# Altium schematic sheet E16-02-001.SchDoc
size A4
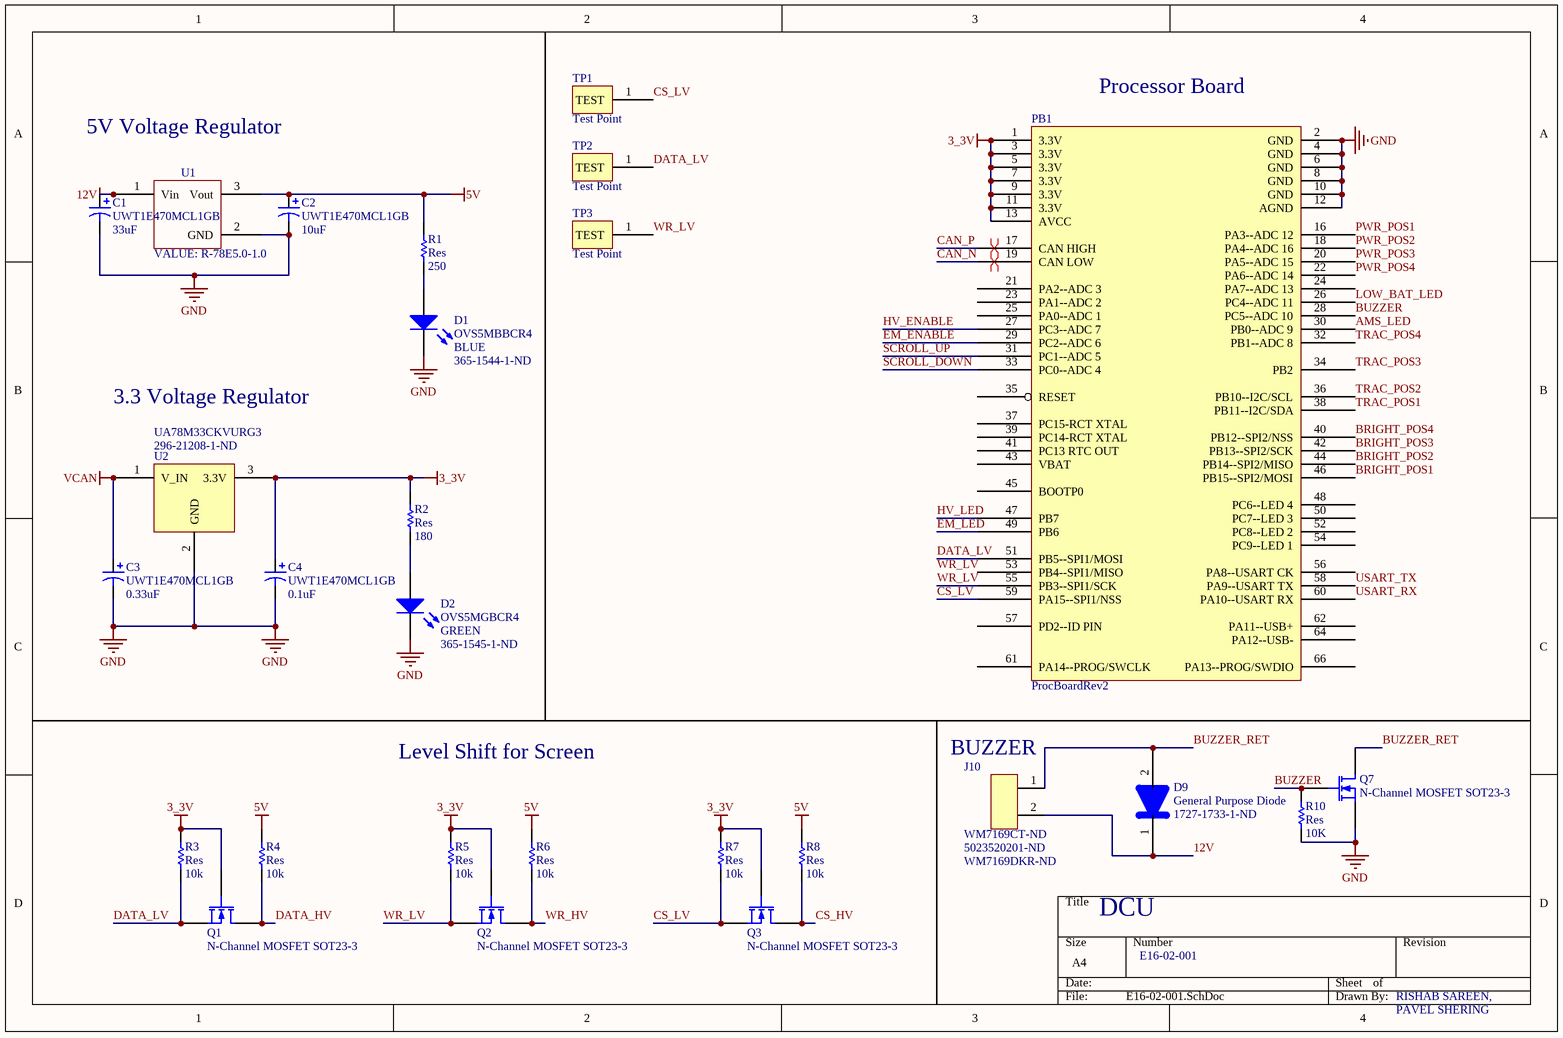
[diagram p0: E16-02-001.SchDoc]

## Parts
C1  UWT1E470MCL1GB  value 33uF  [UWT1E470MCL1GB]
C2  UWT1E470MCL1GB  value 10uF  [UWT1E470MCL1GB]
C3  UWT1E470MCL1GB  value 0.33uF  [UWT1E470MCL1GB]
C4  UWT1E470MCL1GB  value 0.1uF  [UWT1E470MCL1GB]
D1  OVS5MBBCR4  Colour: BLUE  Supplier Part Number 1: 365-1544-1-ND  [OVS5MBBCR4]
D2  OVS5MGBCR4  Colour: GREEN  Supplier Part Number 1: 365-1545-1-ND  [OVS5MGBCR4]
D9  General Purpose Diode  Digikey P/N: 1727-1733-1-ND  [SODFL350X110-2N]
J10  Supplier Part Number 1: 5023520201-ND  Supplier Part Number 2: WM7169DKR-ND  [MOLEX_DURACLIK_2]  (hidden comment: J_5023520200)
PB1  ProcBoardRev2  [PROC_BOARD]
Q1  N-Channel MOSFET SOT23-3  [SOT23-3]
Q2  N-Channel MOSFET SOT23-3  [SOT23-3]
Q3  N-Channel MOSFET SOT23-3  [SOT23-3]
Q7  N-Channel MOSFET SOT23-3  [SOT23-3]
R1  Res  value 250  [3216[1206]]
R2  Res  value 180  [3216[1206]]
R3  Res  value 10k  [3216[1206]]
R4  Res  value 10k  [3216[1206]]
R5  Res  value 10k  [3216[1206]]
R6  Res  value 10k  [3216[1206]]
R7  Res  value 10k  [3216[1206]]
R8  Res  value 10k  [3216[1206]]
R10  Res  value 10K  [3216[1206]]
TP1  Test Point  [TEST POINT 5000K]
TP2  Test Point  [TEST POINT 5000K]
TP3  Test Point  [TEST POINT 5000K]
U1  R-78E5.0-1.0  [R-78E5.0-1.0]
U2  UA78M33CKVURG3  Supplier Part Number 1: 296-21208-1-ND  [TO-252-3]

## Nets
3_3V: C4.1 PB1.1(3.3V) PB1.3(3.3V) PB1.5(3.3V) PB1.7(3.3V) PB1.9(3.3V) PB1.11(3.3V) PB1.13(AVCC) Q1.1(G) Q2.1(G) Q3.1(G) R2.2 R3.2 R5.2 R7.2 U2.3(3.3V)
5V: C2.1 R1.2 R4.2 R6.2 R8.2 U1.3(Vout)
12V: C1.1 D9.1 J10.2 U1.1(Vin)
GND: C1.2 C2.2 C3.2 C4.2 D1.2(K) D2.2(K) PB1.2(GND) PB1.4(GND) PB1.6(GND) PB1.8(GND) PB1.10(GND) PB1.12(AGND) Q7.2(S) R10.1 U1.2(GND) U2.2(GND)
VCAN: C3.1 U2.1(V_IN)
AMS_LED: PB1.30(PB0--ADC_9)
BRIGHT_POS1: PB1.46(PB15--SPI2/MOSI)
BRIGHT_POS2: PB1.44(PB14--SPI2/MISO)
BRIGHT_POS3: PB1.42(PB13--SPI2/SCK)
BRIGHT_POS4: PB1.40(PB12--SPI2/NSS)
BUZZER: PB1.28(PC5--ADC_10) Q7.1(G) R10.2
BUZZER_RET: D9.2 J10.1 Q7.3(D)
CAN_N: PB1.19(CAN_LOW)
CAN_P: PB1.17(CAN_HIGH)
CS_HV: Q3.3(D) R8.1
CS_LV: PB1.59(PA15--SPI1/NSS) Q3.2(S) R7.1 TP1.1(TEST)
DATA_HV: Q1.3(D) R4.1
DATA_LV: PB1.51(PB5--SPI1/MOSI) Q1.2(S) R3.1 TP2.1(TEST)
EM_ENABLE: PB1.29(PC2--ADC_6)
EM_LED: PB1.49(PB6)
HV_ENABLE: PB1.27(PC3--ADC_7)
HV_LED: PB1.47(PB7)
LOW_BAT_LED: PB1.26(PC4--ADC_11)
PWR_POS1: PB1.16(PA3--ADC_12)
PWR_POS2: PB1.18(PA4--ADC_16)
PWR_POS3: PB1.20(PA5--ADC_15)
PWR_POS4: PB1.22(PA6--ADC_14)
SCROLL_DOWN: PB1.33(PC0--ADC_4)
SCROLL_UP: PB1.31(PC1--ADC_5)
TRAC_POS1: PB1.38(PB11--I2C/SDA)
TRAC_POS2: PB1.36(PB10--I2C/SCL)
TRAC_POS3: PB1.34(PB2)
TRAC_POS4: PB1.32(PB1--ADC_8)
USART_RX: PB1.60(PA10--USART_RX)
USART_TX: PB1.58(PA9--USART_TX)
WR_HV: Q2.3(D) R6.1
WR_LV: PB1.55(PB3--SPI1/SCK) Q2.2(S) R5.1 TP3.1(TEST)
NetD1_1: D1.1(A) R1.1
NetD2_1: D2.1(A) R2.1

Not connected (* = marked no-connect by the designer): PB1 14(NC) 15(NC) 21(PA2--ADC_3) 23(PA1--ADC_2) 24(PA7--ADC_13) 25(PA0--ADC_1) 35(RESET) 37(PC15-RCT_XTAL) 39(PC14-RCT_XTAL) 41(PC13_RTC_OUT) 43(VBAT) 45(BOOTP0) 48(PC6--LED_4) 50(PC7--LED_3) 52(PC8--LED_2) 53(PB4--SPI1/MISO) 54(PC9--LED_1) 56(PA8--USART_CK) 57(PD2--ID_PIN) 61(PA14--PROG/SWCLK) 62(PA11--USB+) 63(NC) 64(PA12--USB-) 65(NC) 66(PA13--PROG/SWDIO) 67

## Layout directives
differential pair: CAN_N, CAN_P

## Notes on the sheet
- (near PB1) Processor Board
- 5V Voltage Regulator
- 3.3 Voltage Regulator
- Level Shift for Screen
- (near J10) BUZZER
- DCU
- E16-02-001
- RISHAB SAREEN,
- PAVEL SHERING
- Labels drawn without touching a wire or pin: WR_LV

## Library data of the parts
C1-C4 = UWT1E470MCL1GB: CAP ALUM 47UF 25V 20% SMD; Published: 8-Jun-2000; LatestRevisionDate: 17-Jul-2002; LatestRevisionNote: Re-released for DXP Platform.; PackageReference: POLAR0.8; Publisher: Altium Limited; PackageDescription: Polarized Capacitor; 2 Leads
D1 = OVS5MBBCR4: Typical BLUE LED; Published: 8-Jun-2000; LatestRevisionDate: 17-Jul-2002; LatestRevisionNote: Re-released for DXP Platform.; PackageDocument: Feb-2002; PackageReference: 3.2X1.6X1.1; Publisher: Altium Limited; Supplier 1: Digi-Key
D2 = OVS5MGBCR4: Typical GREEN LED; Published: 8-Jun-2000; LatestRevisionDate: 17-Jul-2002; LatestRevisionNote: Re-released for DXP Platform.; PackageDocument: Feb-2002; PackageReference: 3.2X1.6X1.1; Publisher: Altium Limited; Supplier 1: Digi-Key
J10 = J_5023520200: MOLEX DURACLIK 2-PIN RA; Digikey_PN: WM7169CT-ND; Supplier 1: Digi-Key; Supplier 2: Digi-Key
PB1 = ProcBoardRev2: Processor board that carries the STM32F072RB
Q1-Q3 Q7 = MOSFET-N SOT23-3
R1-R8 R10 = Res: Surface Mount Resistor; Published: 8-Jun-2000; LatestRevisionDate: 17-Jul-2002; LatestRevisionNote: Re-released for DXP Platform.; PackageReference: AXIAL-0.5; Publisher: Altium Limited
TP1-TP3 = Test Point: 5000-5004, 5015-5019 Keystone Electronics
U1 = R-78E5.0-1.0: Recom Power 28V to 5V; MFG: Recom Power; Supplier Part Number 1: 945-2201-ND; MFG_PN: R-78E5.0-1.0; Supplier 1: Digi-Key; VALUE: R-78E5.0-1.0
U2 = UA78M33CKVURG3: 3.3V Regulator; Supplier 1: Digi-Key